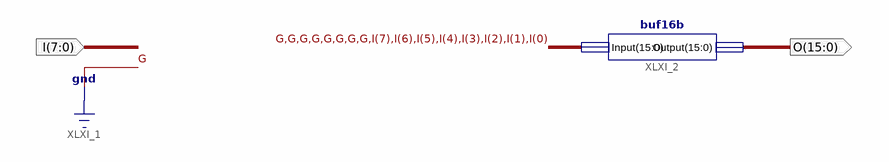
[diagram p0: schematic sheet 1]
// Xilinx ISE schematic extend8b16.sch (spartan3e) as structural Verilog: 1 symbols, 2 ports
module extend8b16 (
  input  [7:0] I,
  output [15:0] O
);

  buf16b XLXI_2 (.Input({{8{1'b0}}, I}), .Output(O));
endmodule
